# EasyEDA schematic circuit-connections.json
TITLE: Sheet_1; REV: 1.0; Date: 2025-03-05; Sheet: 1/1; Drawn By: Music Live; Company: Your Company
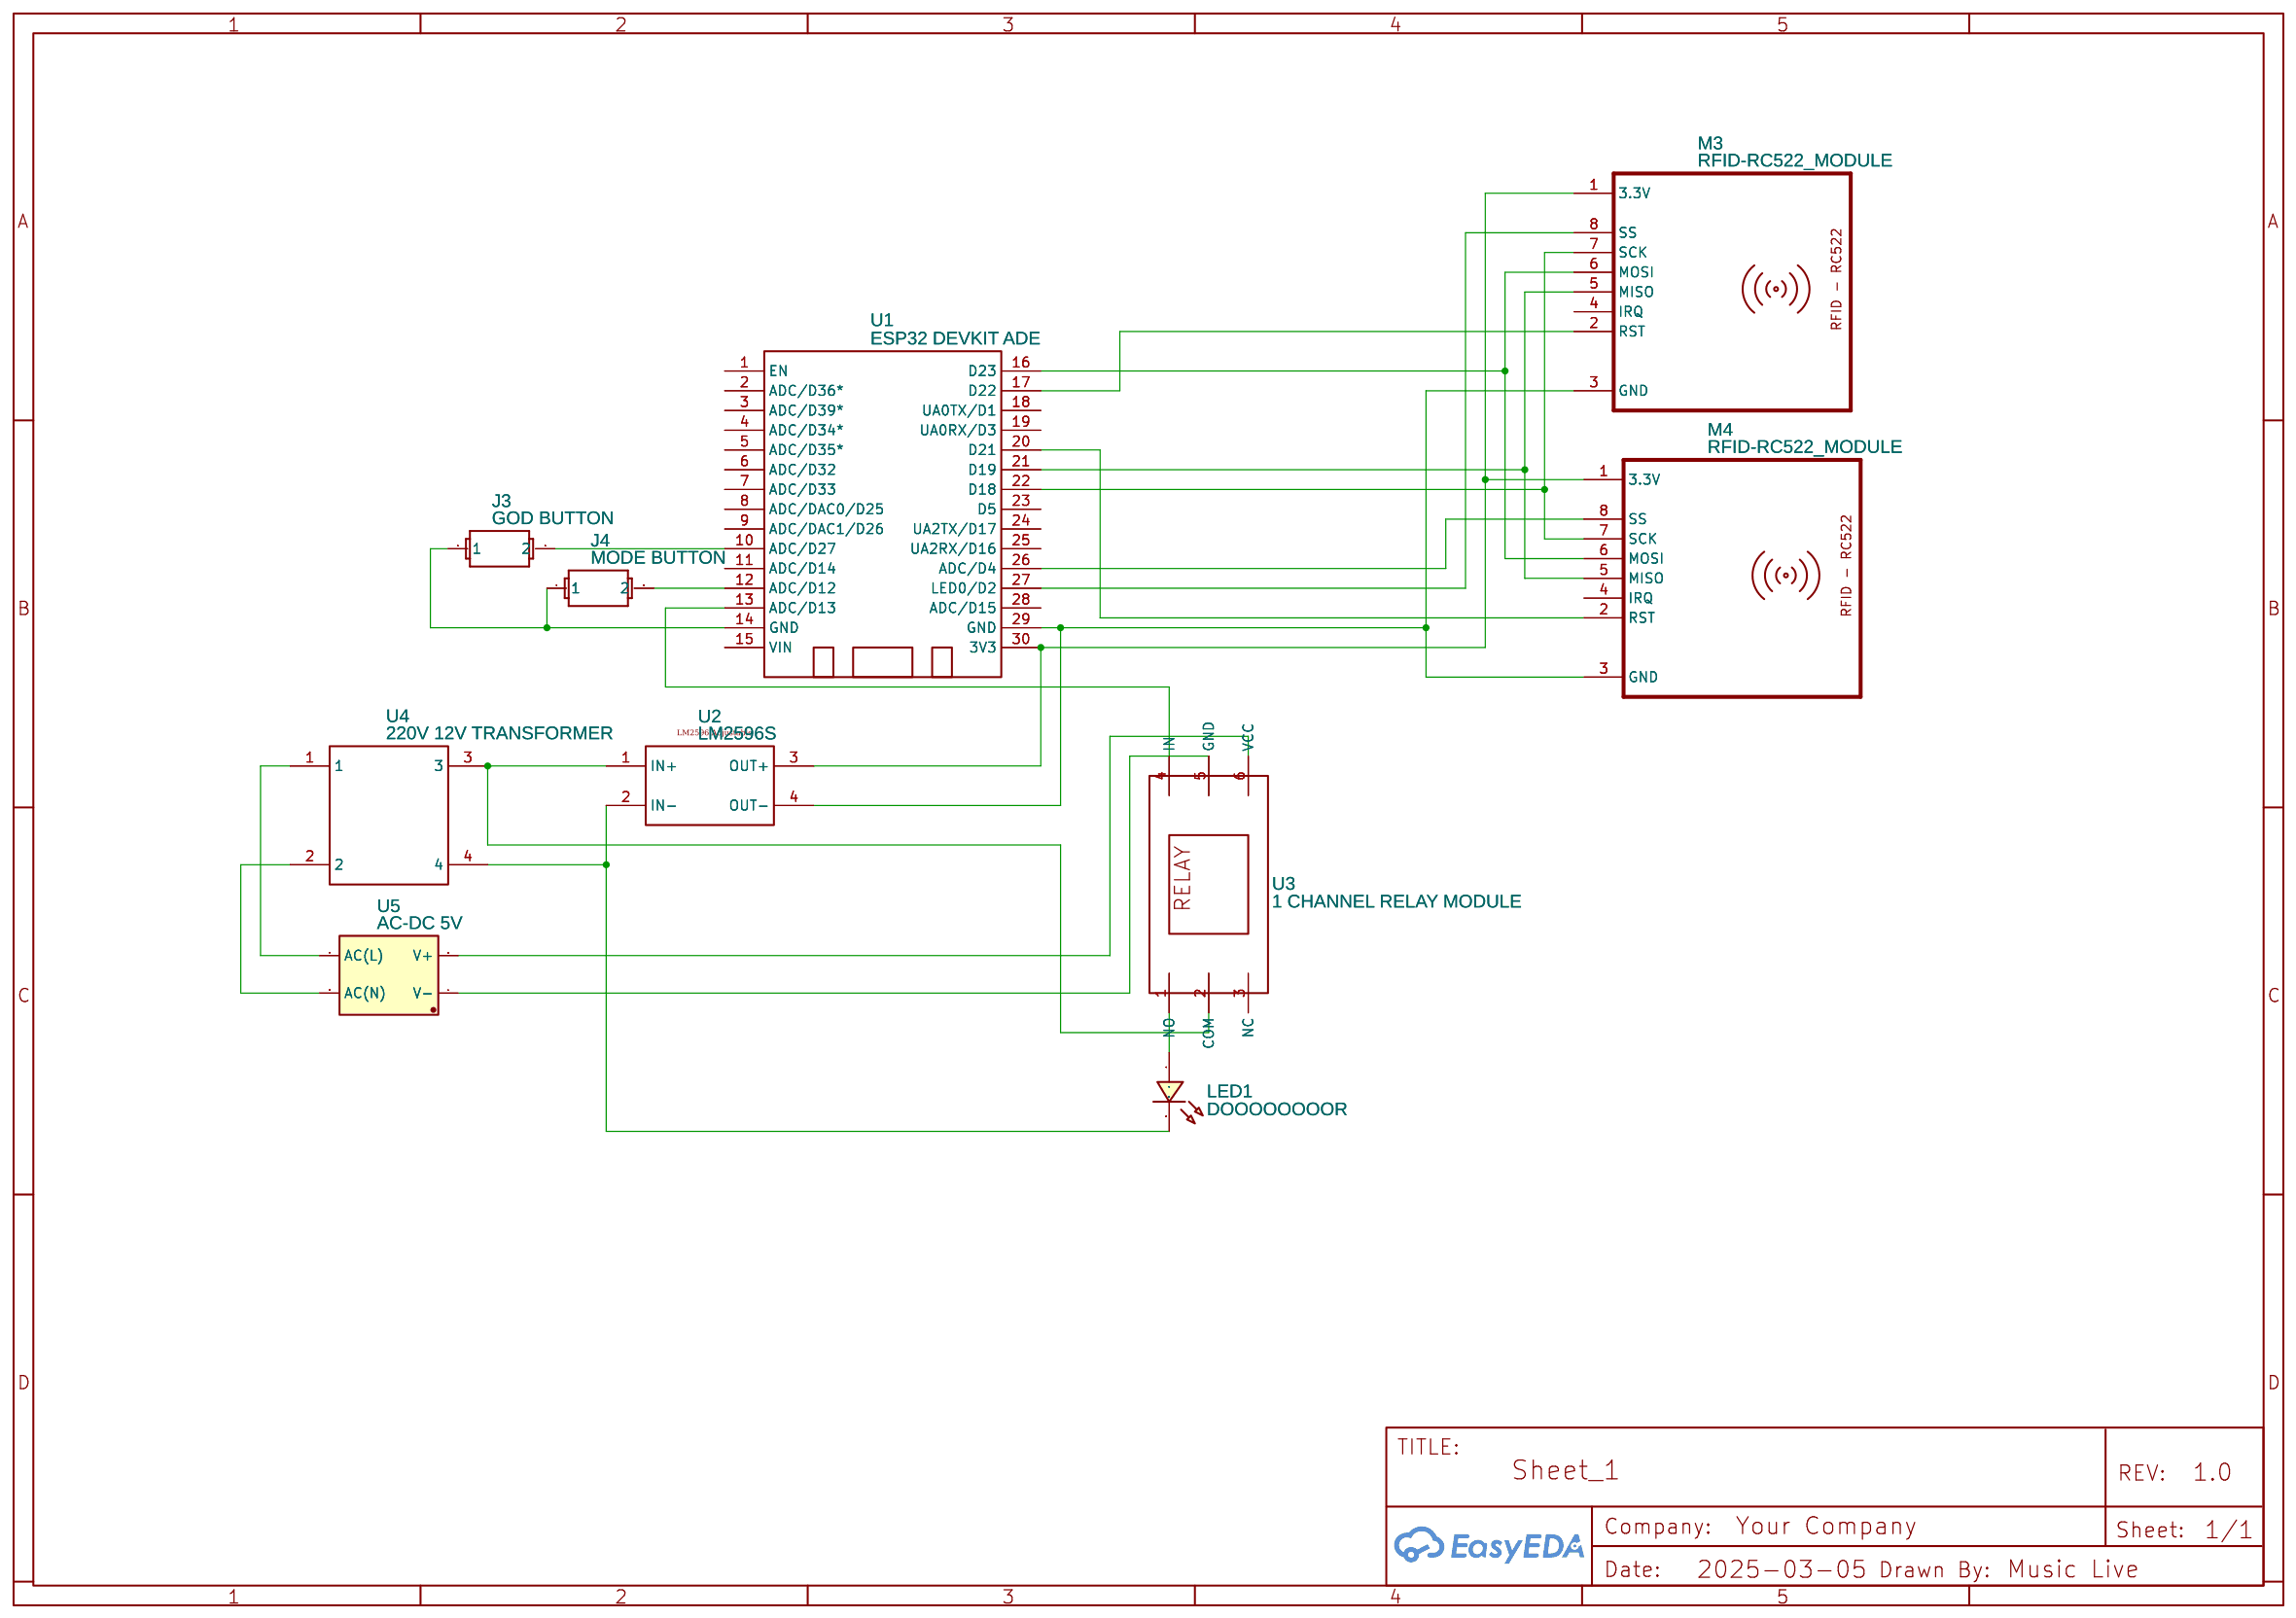
[diagram p0: schematic sheet]

## Parts
J3  GOD BUTTON  [BUTTON_TD1183SA_BUTTON_TD1183SA]
J4  MODE BUTTON  [BUTTON_TD1183SA_BUTTON_TD1183SA]
LED1  DOOOOOOOOR  [LED0603_RED]
M3  RFID-RC522_MODULE  [RFID-RC522]
M4  RFID-RC522_MODULE  [RFID-RC522]
U1  ESP32 DEVKIT ADE  [DOIT-ESP32-DEVKIT-V1]
U2  LM2596S  [LM2596:YAAJ_DCDC_STEPDOWN_LM2596]
U3  1 CHANNEL RELAY MODULE  [1 CHANNEL RELAY MODULE]
U4  220V 12V TRANSFORMER  [220V 12V TRANSFORMER]
U5  AC-DC 5V  [AC-DC-5V-700MA]

## Library data of the parts
J3 J4 = BUTTON_TD1183SA_BUTTON_TD1183SA: Contributor: corantin.allory
LED1 = LED-0603_R: Manufacturer: EVERLIGHT(台湾亿光); Manufacturer Part: 19-217/R6C-AL1M2VY/3T; Supplier Part: C72044; Supplier: LCSC; Contributor: LCEDA_01
M3 M4 = RFID-RC522_MODULE: Contributor: sidelirosamenezes
U1 = ESP32 DEVKIT ADE: Contributor: ConceitoTeam
U2 = BuckConverters_LM2596_Adj: Servo 5V; Add into BOM: yes; Convert to PCB: yes; Origin Footprint: YAAJ_DCDC_StepDown_LM2596; Contributor: ee22b001
U3 = 1 CHANNEL RELAY MODULE: Contributor: jyotik.simaria
U4 = 220V 12V TRANSFORMER: Contributor: Harsh_Rana
U5 = AC-DC 5V: Supplier Part: C355007; Manufacturer: HIECUBE; Manufacturer Part: AC-DC 5v 700mA; Contributor: tanguy.vandernoot

## Nets
Net-(J3-1): J3.1 J4.1 U1.14(GND)
Net-(J3-2): J3.2 U1.10(ADC/D27)
Net-(J4-2): J4.2 U1.12(ADC/D12)
Net-(LED1-1): LED1.1 U3.1(NO)
Net-(LED1-2): LED1.2 U2.2(IN-) U4.4
Net-(M3-1): M3.1(3.3V) M4.1(3.3V) U1.30(3V3) U2.3(OUT+)
Net-(M3-2): M3.2(RST) U1.17(D22)
Net-(M3-3): M3.3(GND) M4.3(GND) U1.29(GND) U2.4(OUT-)
Net-(M3-5): M3.5(MISO) M4.5(MISO) U1.21(D19)
Net-(M3-6): M3.6(MOSI) M4.6(MOSI) U1.16(D23)
Net-(M3-7): M3.7(SCK) M4.7(SCK) U1.22(D18)
Net-(M3-8): M3.8(SS) U1.27(LED0/D2)
Net-(M4-2): M4.2(RST) U1.20(D21)
Net-(M4-8): M4.8(SS) U1.26(ADC/D4)
Net-(U1-13): U1.13(ADC/D13) U3.4(IN)
Net-(U2-1): U2.1(IN+) U3.2(COM) U4.3
Net-(U3-5): U3.5(GND) U5.4(V-)
Net-(U3-6): U3.6(VCC) U5.3(V+)
Net-(U4-1): U4.1 U5.1(AC(L))
Net-(U4-2): U4.2 U5.2(AC(N))

Not connected (* = marked no-connect by the designer): M3 4(IRQ); M4 4(IRQ); U1 1(EN) 2(ADC/D36*) 3(ADC/D39*) 4(ADC/D34*) 5(ADC/D35*) 6(ADC/D32) 7(ADC/D33) 8(ADC/DAC0/D25) 9(ADC/DAC1/D26) 11(ADC/D14) 15(VIN) 18(UA0TX/D1) 19(UA0RX/D3) 23(D5) 24(UA2TX/D17) 25(UA2RX/D16) 28(ADC/D15); U3 3(NC)
